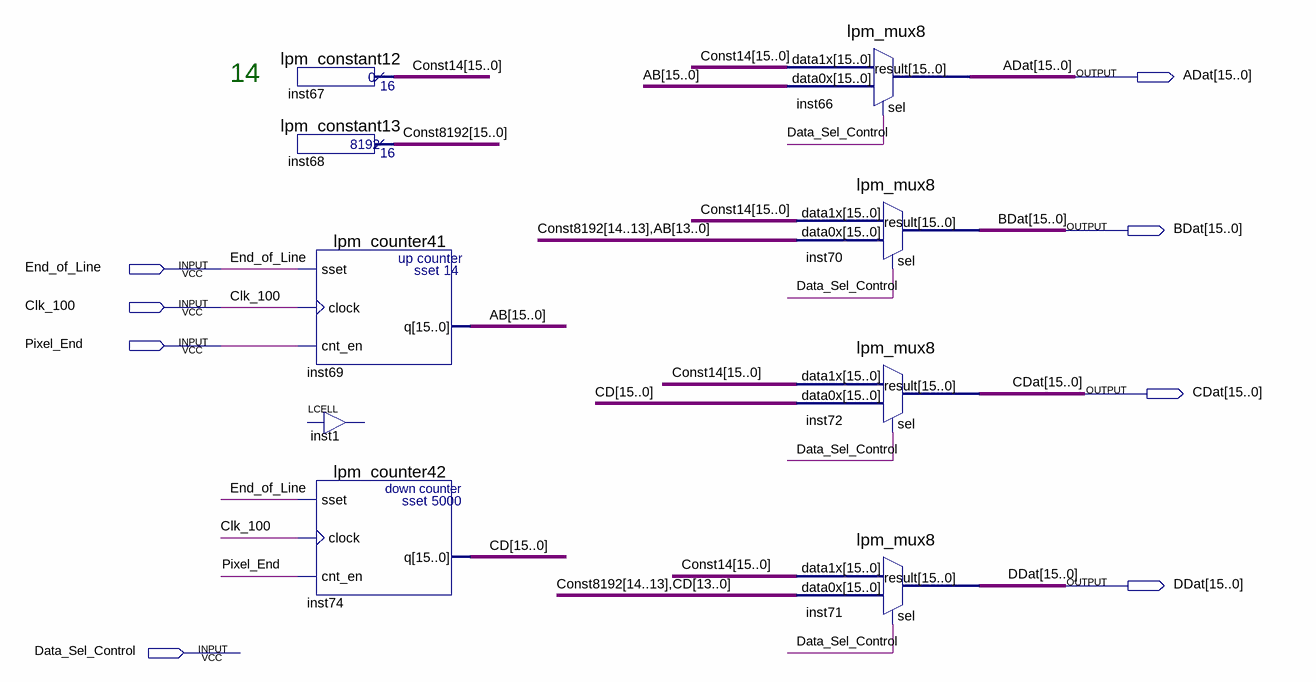
[diagram p0: schematic sheet]
// Quartus schematic Data_Gen.bdf as structural Verilog: 9 symbols, 8 pins
module Data_Gen (
  input  End_of_Line,
  input  Clk_100,
  input  Pixel_End,
  input  Data_Sel_Control,
  output [15:0] ADat,
  output [15:0] BDat,
  output [15:0] CDat,
  output [15:0] DDat
);

  wire [15:0] AB, CD, Const14, Const8192;

  lpm_constant12 inst67 (.result(Const14));
  lpm_constant13 inst68 (.result(Const8192));
  lpm_counter41 inst69 (.sset(End_of_Line), .clock(Clk_100), .cnt_en(Pixel_End), .q(AB));
  LCELL inst1 ();  // open: IN, OUT
  lpm_counter42 inst74 (.sset(End_of_Line), .clock(Clk_100), .cnt_en(Pixel_End), .q(CD));
  lpm_mux8 inst66 (.data1x(Const14), .data0x(AB), .sel(Data_Sel_Control), .result(ADat));
  lpm_mux8 inst70 (.data1x(Const14), .data0x({Const8192[14:13], AB[13:0]}), .sel(Data_Sel_Control), .result(BDat));
  lpm_mux8 inst72 (.data1x(Const14), .data0x(CD), .sel(Data_Sel_Control), .result(CDat));
  lpm_mux8 inst71 (.data1x(Const14), .data0x({Const8192[14:13], CD[13:0]}), .sel(Data_Sel_Control), .result(DDat));

  // Notes on the sheet:
  //   14
endmodule
